# EAGLE design Keypad (EAGLE 5.11)
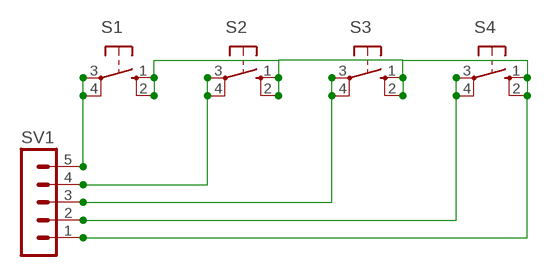
[diagram p0: schematic, sheet 1]

## Parts
S1  40/XXNOHOLES  [B3F-40XXNOHOLES]
S2  40/XXNOHOLES  [B3F-40XXNOHOLES]
S3  40/XXNOHOLES  [B3F-40XXNOHOLES]
S4  40/XXNOHOLES  [B3F-40XXNOHOLES]
SV1  MA05-1  [MA05-1]

## Nets
N$6: S4.3(P) S4.4(P1) SV1.2
N$7: S3.3(P) S3.4(P1) SV1.3
N$8: S2.3(P) S2.4(P1) SV1.4
N$9: S1.3(P) S1.4(P1) SV1.5
N$21: S1.1(S) S1.2(S1) S2.1(S) S2.2(S1) S3.1(S) S3.2(S1) S4.1(S) S4.2(S1) SV1.1

## Library data of the parts
S1-S4 = switch-omron:40/XXNOHOLES
SV1 = con-lstb:MA05-1: PIN HEADER; OC_FARNELL: unknown; OC_NEWARK: unknown

## Board
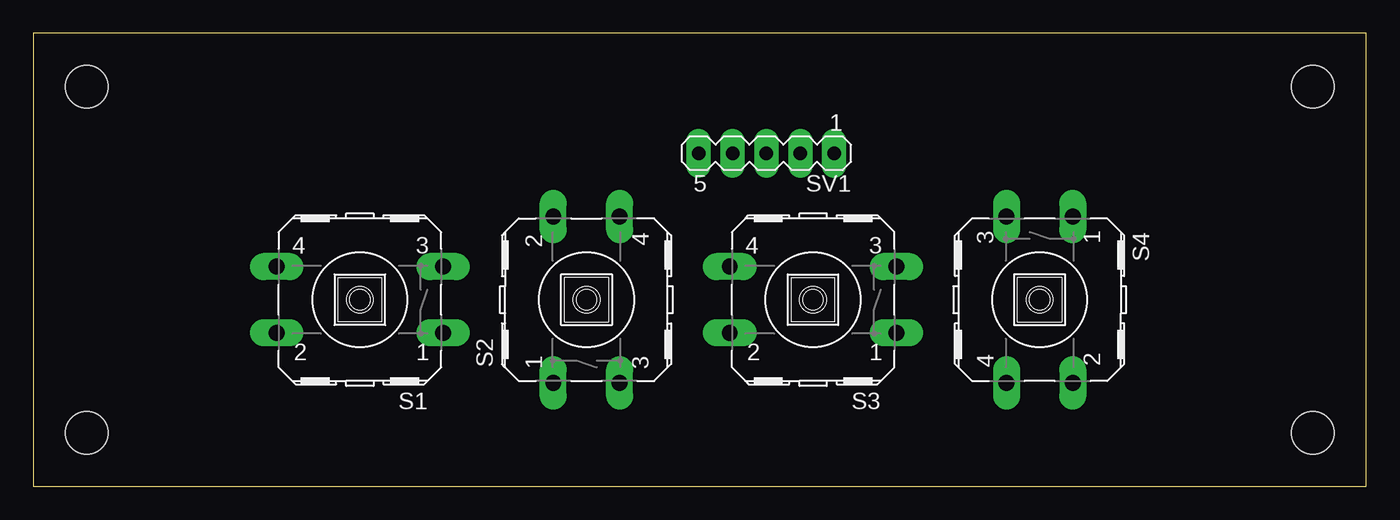
[diagram p1: board, top side]
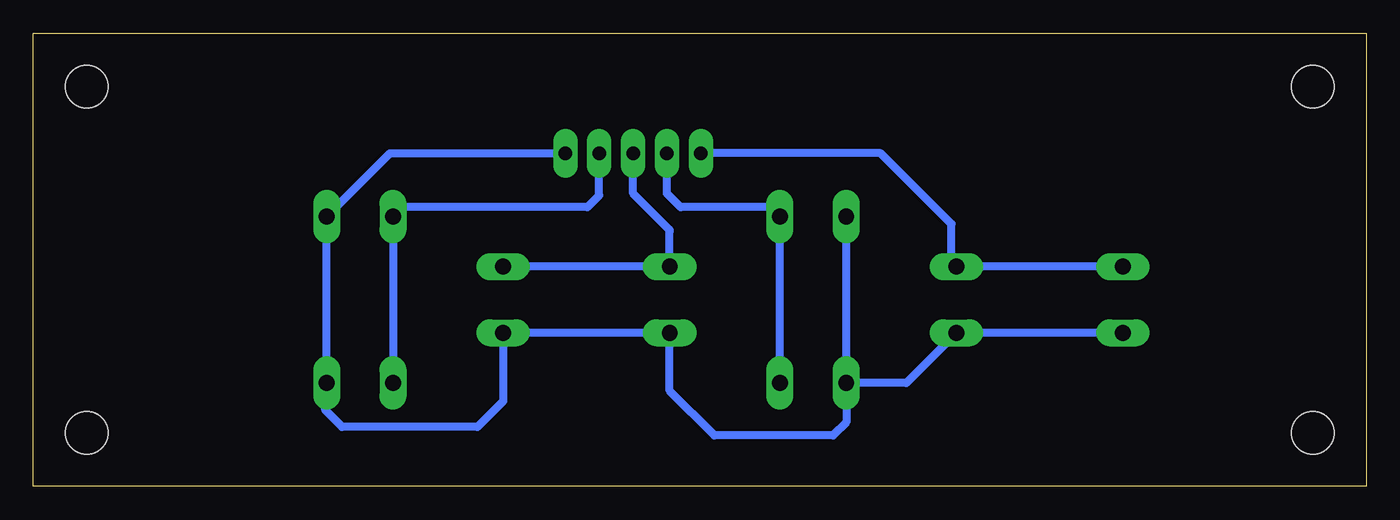
[diagram p2: board, bottom side, seen from below]

Size 100 x 34 mm. Coordinates in mm from the lower left corner, seen from the top.
Outline: 0,0 100,0 100,34 0,34 0,0
Copper layers (1*16): Top 0.035mm / dielectric 1.5mm / Bottom 0.035mm
Design rules "test": minimum track width 16mil, minimum drill 20mil, track to track 16mil, track to pad 16mil, pad to pad 16mil, via to via 16mil, smd to smd 8mil, copper to edge 10mil, drill to drill 8mil, minimum pad ring 16mil, minimum via ring 20mil, stop-mask expansion 2mil, vias tented up to drill 25mil, thermal gap 10mil
Holes 3.2 mm at 4,30 4,4 96,30 96,4

### Footprints (pad centres in the part's own frame; a part is rotated, then mirrored left to right if it is on the bottom)
B3F-40XXNOHOLES = drill 1.194 long: 1 -6.248,2.489; 2 6.248,2.489; 3 -6.248,-2.489; 4 6.248,-2.489
MA05-1 = drill 1.016 long: 1 -5.08,0; 2 -2.54,0; 3 0,0; 4 2.54,0; 5 5.08,0

### Placement (x,y rotation side)
S1  24.5,14 180 top
S2  41.5,14 90 top
S3  58.5,14 180 top
S4  75.5,14 270 top
SV1  55,25 180 top

### Tracks (layer width: path | path; a pad name or v marks a point on that pad's centre or on a via)
N$6
  Bottom 0.61: S4.4 S4.3 72.3,20.95 58.42,20.95 57.54,21.84 SV1.2
N$7
  Bottom 0.61: S3.4 S3.3 | SV1.3 55,21.98 52.33,19.31 arc45 52.25,19.13 S3.4 | S3.4 52.07,16.56
N$8
  Bottom 0.61: S2.3 S2.4 44.7,20.95 51.44,20.95 52.46,21.98 SV1.4
N$9
  Bottom 0.61: S1.4 30.46,16.49 30.48,16.51 | 30.48,16.51 31.11,17.14 | 30.48,16.51 30.5,16.49 S1.3 31.11,16.86 31.11,19.68 36.43,25 SV1.5
N$21
  Bottom 0.61: S1.2 S1.1 34.51,7.75 S2.1 | S2.1 S2.2 | S2.1 39.01,4.8 40.01,3.81 48.9,3.81 52.25,7.17 S3.2 S3.1 64.75,6.37 66.67,4.45 76.83,4.45 78.11,5.71 78.11,7.64 S4.2 S4.1 73.24,25 SV1.1